# Altium schematic sheet IPMC_MACP 2.SchDoc
size A3
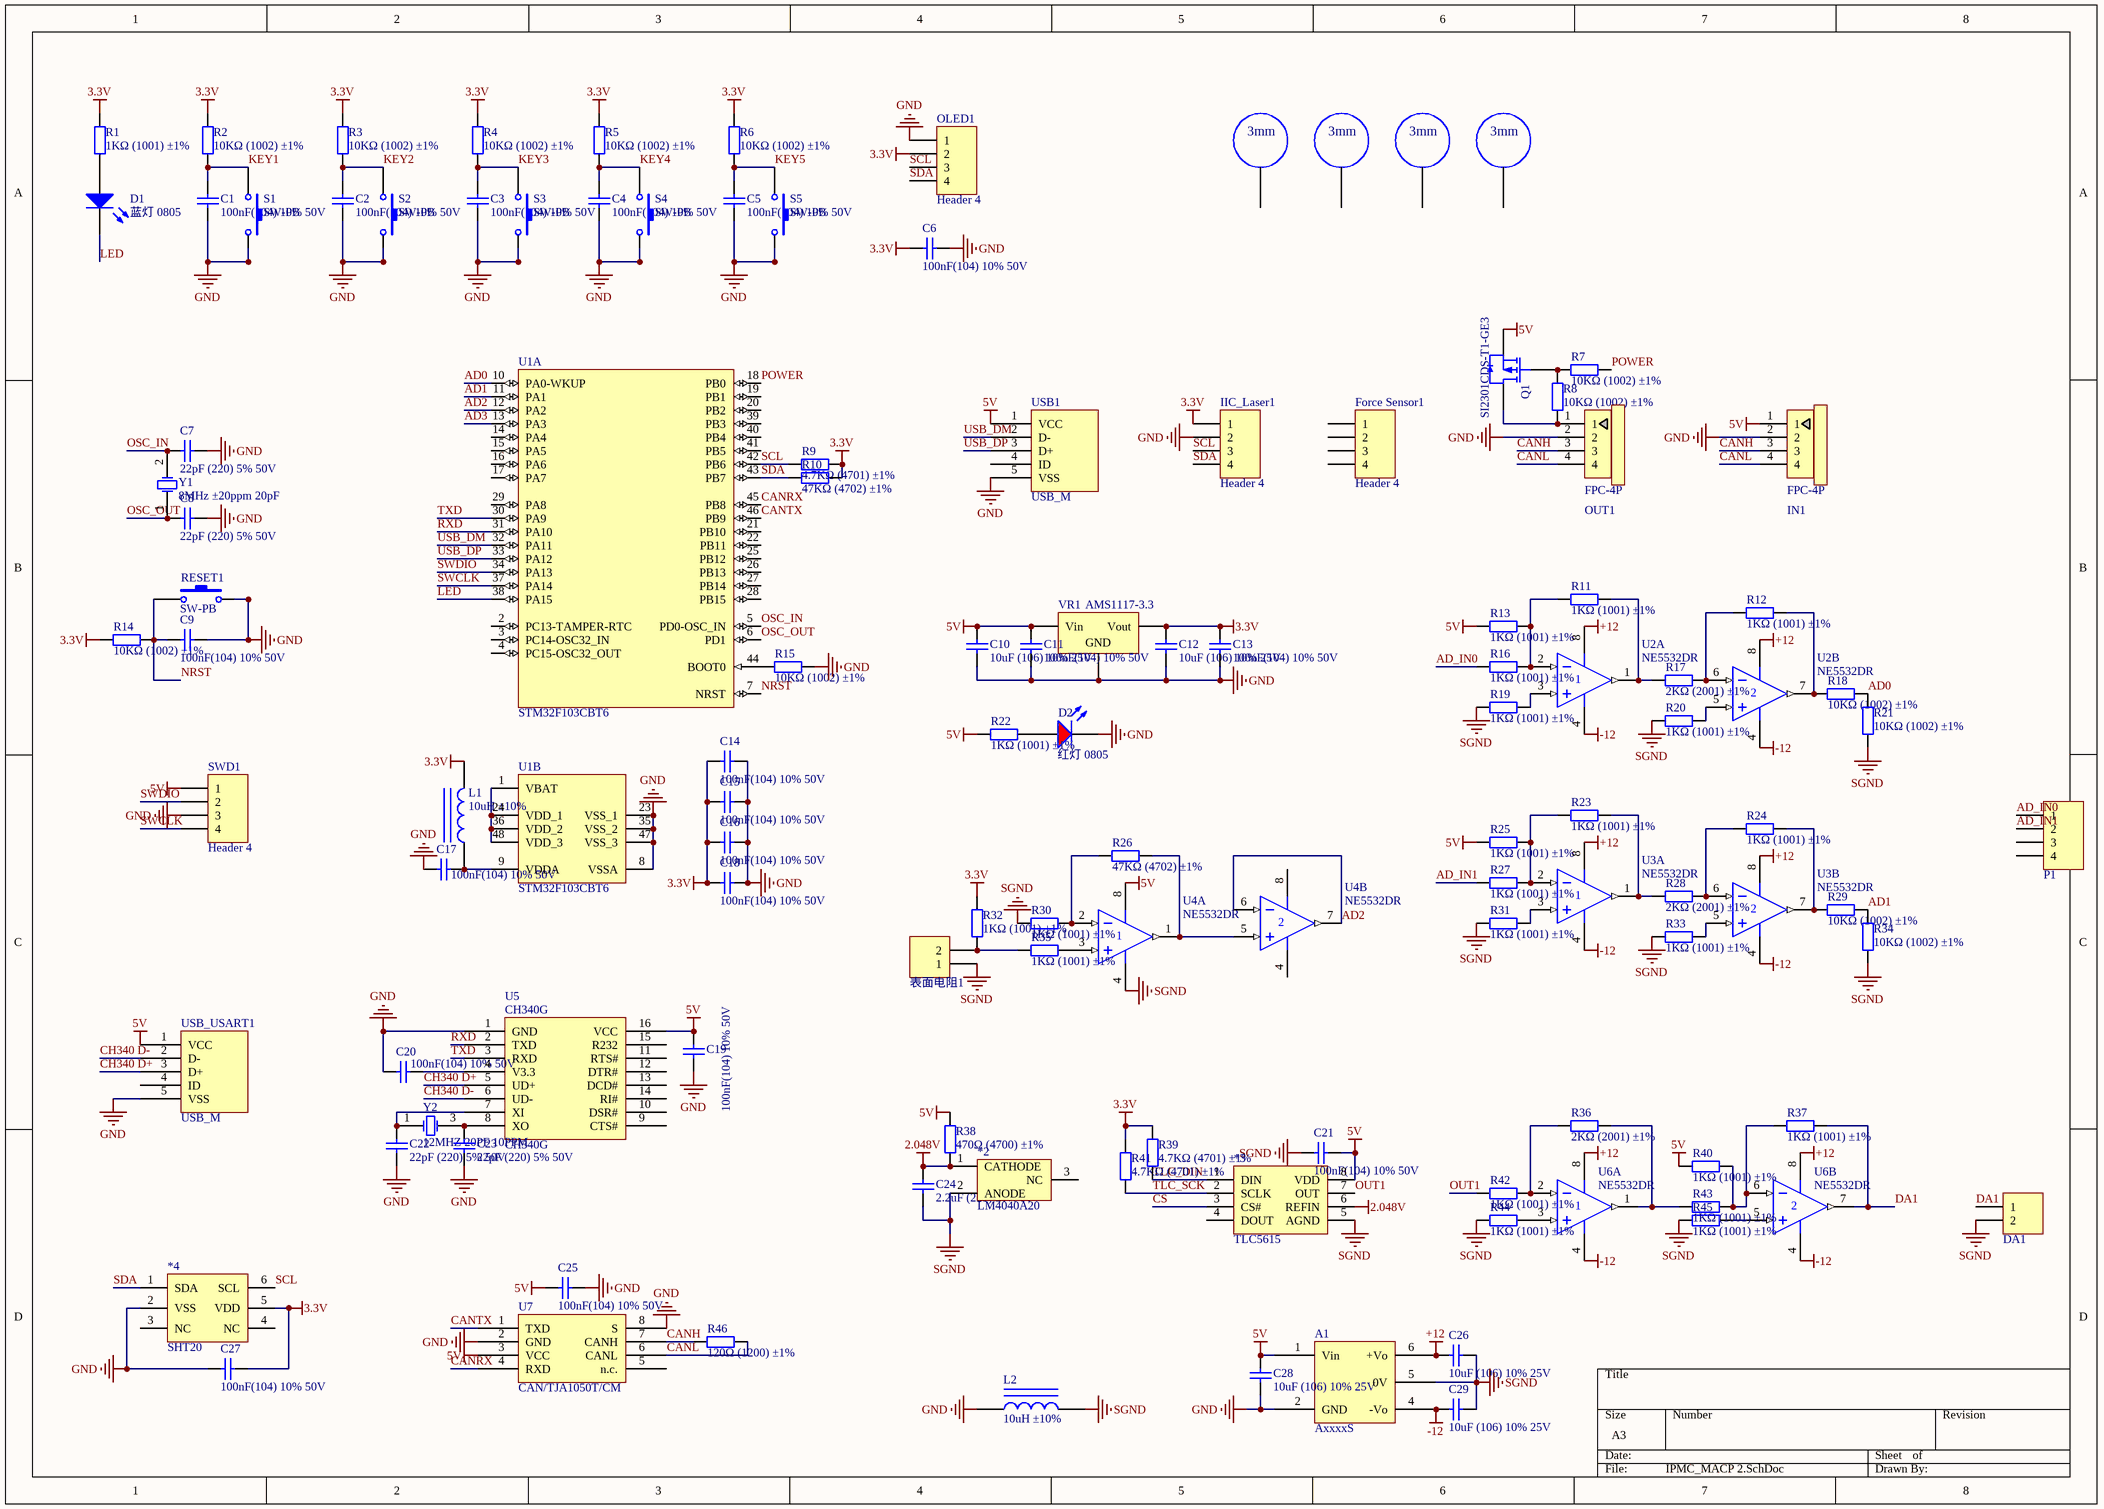
[diagram p0: IPMC_MACP 2.SchDoc]

## Parts
*2  LM4040A20  [SOT-23]
*3  TLC5615  [SOP-8]
*4  SHT20  [DFN6]
A1  AxxxxS  [AxxxxS]
C1  100nF(104) 10% 50V  [0805_C]
C2  100nF(104) 10% 50V  [0805_C]
C3  100nF(104) 10% 50V  [0805_C]
C4  100nF(104) 10% 50V  [0805_C]
C5  100nF(104) 10% 50V  [0805_C]
C6  100nF(104) 10% 50V  [0805_C]
C7  22pF (220) 5% 50V  [0805_C]
C8  22pF (220) 5% 50V  [0805_C]
C9  100nF(104) 10% 50V  [0805_C]
C10  10uF (106) 10% 25V  [0805_C]
C11  100nF(104) 10% 50V  [0805_C]
C12  10uF (106) 10% 25V  [0805_C]
C13  100nF(104) 10% 50V  [0805_C]
C14  100nF(104) 10% 50V  [0805_C]
C15  100nF(104) 10% 50V  [0805_C]
C16  100nF(104) 10% 50V  [0805_C]
C17  100nF(104) 10% 50V  [0805_C]
C18  100nF(104) 10% 50V  [0805_C]
C19  100nF(104) 10% 50V  [0805_C]
C20  100nF(104) 10% 50V  [0805_C]
C21  100nF(104) 10% 50V  [0805_C]
C22  22pF (220) 5% 50V  [0805_C]
C23  22pF (220) 5% 50V  [0805_C]
C24  2.2uF (225) 20% 50V  [0805_C]
C25  100nF(104) 10% 50V  [0805_C]
C26  10uF (106) 10% 25V  [0805_C]
C27  100nF(104) 10% 50V  [0805_C]
C28  10uF (106) 10% 25V  [0805_C]
C29  10uF (106) 10% 25V  [0805_C]
D1  蓝灯 0805  [0805_LED_S1]
D2  红灯 0805  [0805_LED_S1]
DA1  Header 2  [HDR2X1_A]  (value not drawn)
Force_Sensor1  Header 4  [HDR1X4]
IIC_Laser1  Header 4  [HDR1X4]
IN1  FPC-4P  [FPC1.0-4P-A]
L1  10uH ±10%  [0805_L]
L2  10uH ±10%  [0805_L]
OLED1  Header 4  [HDR1X4]
OUT1  FPC-4P  [FPC1.0-4P-A]
P1  Header 4  [HDR4X1_A]  (value not drawn)
Q1  SI2301CDS-T1-GE3  [SOT-23(SOT-23-3)]
R1  1KΩ (1001) ±1%  [0805_R]
R2  10KΩ (1002) ±1%  [0805_R]
R3  10KΩ (1002) ±1%  [0805_R]
R4  10KΩ (1002) ±1%  [0805_R]
R5  10KΩ (1002) ±1%  [0805_R]
R6  10KΩ (1002) ±1%  [0805_R]
R7  10KΩ (1002) ±1%  [0805_R]
R8  10KΩ (1002) ±1%  [0805_R]
R9  4.7KΩ (4701) ±1%  [0805_R]
R10  47KΩ (4702) ±1%  [0805_R]
R11  1KΩ (1001) ±1%  [0805_R]
R12  1KΩ (1001) ±1%  [0805_R]
R13  1KΩ (1001) ±1%  [0805_R]
R14  10KΩ (1002) ±1%  [0805_R]
R15  10KΩ (1002) ±1%  [0805_R]
R16  1KΩ (1001) ±1%  [0805_R]
R17  2KΩ (2001) ±1%  [0805_R]
R18  10KΩ (1002) ±1%  [0805_R]
R19  1KΩ (1001) ±1%  [0805_R]
R20  1KΩ (1001) ±1%  [0805_R]
R21  10KΩ (1002) ±1%  [0805_R]
R22  1KΩ (1001) ±1%  [0805_R]
R23  1KΩ (1001) ±1%  [0805_R]
R24  1KΩ (1001) ±1%  [0805_R]
R25  1KΩ (1001) ±1%  [0805_R]
R26  47KΩ (4702) ±1%  [0805_R]
R27  1KΩ (1001) ±1%  [0805_R]
R28  2KΩ (2001) ±1%  [0805_R]
R29  10KΩ (1002) ±1%  [0805_R]
R30  1KΩ (1001) ±1%  [0805_R]
R31  1KΩ (1001) ±1%  [0805_R]
R32  1KΩ (1001) ±1%  [0805_R]
R33  1KΩ (1001) ±1%  [0805_R]
R34  10KΩ (1002) ±1%  [0805_R]
R35  1KΩ (1001) ±1%  [0805_R]
R36  2KΩ (2001) ±1%  [0805_R]
R37  1KΩ (1001) ±1%  [0805_R]
R38  470Ω (4700) ±1%  [0805_R]
R39  4.7KΩ (4701) ±1%  [0805_R]
R40  1KΩ (1001) ±1%  [0805_R]
R41  4.7KΩ (4701) ±1%  [0805_R]
R42  1KΩ (1001) ±1%  [0805_R]
R43  1KΩ (1001) ±1%  [0805_R]
R44  1KΩ (1001) ±1%  [0805_R]
R45  1KΩ (1001) ±1%  [0805_R]
R46  120Ω (1200) ±1%  [0805_R]
RESET1  SW-PB  [SW_PB2_A1]
S1  SW-PB  [SW_PB2_A1]
S2  SW-PB  [SW_PB2_A1]
S3  SW-PB  [SW_PB2_A1]
S4  SW-PB  [SW_PB2_A1]
S5  SW-PB  [SW_PB2_A1]
SWD1  Header 4  [HDR1X4]
T1  M3铜柱螺丝孔  [螺丝孔-3mm]  (value not drawn)
T2  M3铜柱螺丝孔  [螺丝孔-3mm]  (value not drawn)
T3  M3铜柱螺丝孔  [螺丝孔-3mm]  (value not drawn)
T4  M3铜柱螺丝孔  [螺丝孔-3mm]  (value not drawn)
U1  STM32F103CBT6  [LQFP-48_7x7x05P]  (parts A,B of 2)
U2  NE5532DR  [SOIC-8_150mil]  (parts A,B of 2)
U3  NE5532DR  [SOIC-8_150mil]  (parts A,B of 2)
U4  NE5532DR  [SOIC-8_150mil]  (parts A,B of 2)
U5  CH340G  [SOIC-16_150mil]
U6  NE5532DR  [SOIC-8_150mil]  (parts A,B of 2)
U7  CAN/TJA1050T/CM  [SOIC-8_150mil]
USB1  USB_M  [USB_MICRO]
USB_USART1  USB_M  [USB_MICRO]
VR1  AMS1117-3.3  [SOT-223]
Y1  8MHz ±20ppm 20pF  [SMD-5032_2P]
Y2  12MHZ 20PF 10PPM  [SMD-3225_4P]
表面电阻1  Header 2  [HDR2X1_A]  (value not drawn)

## Nets
2.048V: *2.1(CATHODE) *3.6(REFIN) C24.2 R38.1
3.3V: *4.5(VDD) C6.2 C12.2 C13.2 C14.2 C15.2 C16.2 C18.2 C27.2 IIC_Laser1.1 L1.2 OLED1.2 R1.1 R2.1 R3.1 R4.1 R5.1 R6.1 R9.2 R10.2 R14.1 R32.1 R39.2 R41.2 VR1.2(Vout)
5V: *3.8(VDD) A1.1(Vin) C10.2 C11.2 C19.2 C21.1 C25.2 C28.2 IN1.1 Q1.2(S) R13.2 R22.1 R25.2 R38.2 R40.2 SWD1.1 U4.8(V+) U5.16(VCC) U7.3(VCC) USB1.1(VCC) USB_USART1.1(VCC) VR1.3(Vin)
+12: A1.6(+Vo) C26.1 U2.8(V+) U3.8(V+) U6.8(V+)
-12: A1.4(-Vo) C29.1 U2.4(V-) U3.4(V-) U6.4(V-)
GND: *4.2(VSS) A1.2(GND) C1.2 C2.2 C3.2 C4.2 C5.2 C6.1 C7.1 C8.1 C9.2 C10.1 C11.1 C12.1 C13.1 C14.1 C15.1 C16.1 C17.1 C18.1 C19.1 C20.2 C22.1 C23.1 C25.1 C27.1 C28.1 D2.K IIC_Laser1.2 IN1.2 L2.1 OLED1.1 OUT1.2 R15.2 RESET1.2 S1.2 S2.2 S3.2 S4.2 S5.2 SWD1.3 U1.8(VSSA) U1.23(VSS_1) U1.35(VSS_2) U1.47(VSS_3) U5.1(GND) U7.2(GND) U7.8(S) USB1.5(VSS) USB_USART1.5(VSS) VR1.1(GND)
SGND: *2.2(ANODE) *3.5(AGND) A1.5(0V) C21.2 C24.1 C26.2 C29.2 DA1.2 L2.2 R19.2 R20.2 R21.1 R30.1 R31.2 R33.2 R34.1 R44.2 R45.2 U4.4(V-) 表面电阻1.1
AD0: R18.2 R21.2 U1.10(PA0-WKUP)
AD1: R29.2 R34.2 U1.11(PA1)
AD2: U1.12(PA2) U4.6(IN-) U4.7(OUT)
AD3: U1.13(PA3)
AD_IN0: P1.1 R16.2
AD_IN1: P1.2 R27.2
CANH: IN1.3 OUT1.3 R46.1 U7.7(CANH)
CANL: IN1.4 OUT1.4 R46.2 U7.6(CANL)
CANRX: U1.45(PB8) U7.4(RXD)
CANTX: U1.46(PB9) U7.1(TXD)
CH340 D+: U5.5(UD+) USB_USART1.3(D+)
CH340 D-: U5.6(UD-) USB_USART1.2(D-)
CS: *3.3(CS#)
DA1: DA1.1 R37.1 U6.7(OUT)
KEY1: C1.1 R2.2 S1.1
KEY2: C2.1 R3.2 S2.1
KEY3: C3.1 R4.2 S3.1
KEY4: C4.1 R5.2 S4.1
KEY5: C5.1 R6.2 S5.1
LED: D1.K U1.38(PA15)
NRST: C9.1 R14.2 RESET1.1 U1.7(NRST)
OSC_IN: C7.2 U1.5(PD0-OSC_IN) Y1.2(OSC2)
OSC_OUT: C8.2 U1.6(PD1) Y1.1(OSC1)
OUT1: *3.7(OUT) R42.2
POWER: R7.2 U1.18(PB0)
RXD: U1.31(PA10) U5.2(TXD)
SCL: *4.6(SCL) IIC_Laser1.3 OLED1.3 R9.1 U1.42(PB6)
SDA: *4.1(SDA) IIC_Laser1.4 OLED1.4 R10.1 U1.43(PB7)
SWCLK: SWD1.4 U1.37(PA14)
SWDIO: SWD1.2 U1.34(PA13)
TLC_DIN: *3.1(DIN) R39.1
TLC_SCK: *3.2(SCLK) R41.1
TXD: U1.30(PA9) U5.3(RXD)
USB_DM: U1.32(PA11) USB1.2(D-)
USB_DP: U1.33(PA12) USB1.3(D+)
NetC17_2: C17.2 L1.1 U1.9(VDDA)
NetC20_1: C20.1 U5.4(V3.3)
NetC22_2: C22.2 U5.7(XI) Y2.1(OSC1)
NetC23_2: C23.2 U5.8(XO) Y2.3(OSC2)
NetD1_A: D1.A R1.2
NetD2_A: D2.A R22.2
NetOUT1_1: OUT1.1 Q1.3(D) R8.2
NetQ1_1: Q1.1(G) R7.1 R8.1
NetR11_1: R11.1 R17.1 U2.1(OUT)
NetR11_2: R11.2 R13.1 R16.1 U2.2(IN-)
NetR12_1: R12.1 R18.1 U2.7(OUT)
NetR12_2: R12.2 R17.2 U2.6(IN-)
NetR15_1: R15.1 U1.44(BOOT0)
NetR19_1: R19.1 U2.3(IN+)
NetR20_1: R20.1 U2.5(IN+)
NetR23_1: R23.1 R28.1 U3.1(OUT)
NetR23_2: R23.2 R25.1 R27.1 U3.2(IN-)
NetR24_1: R24.1 R29.1 U3.7(OUT)
NetR24_2: R24.2 R28.2 U3.6(IN-)
NetR26_1: R26.1 R30.2 U4.2(IN-)
NetR26_2: R26.2 U4.1(OUT) U4.5(IN+)
NetR31_1: R31.1 U3.3(IN+)
NetR32_2: R32.2 R35.1 表面电阻1.2
NetR33_1: R33.1 U3.5(IN+)
NetR35_2: R35.2 U4.3(IN+)
NetR36_1: R36.1 R42.1 U6.2(IN-)
NetR36_2: R36.2 R43.2 U6.1(OUT)
NetR37_2: R37.2 R40.1 R43.1 U6.6(IN-)
NetR44_1: R44.1 U6.3(IN+)
NetR45_1: R45.1 U6.5(IN+)
NetU1_1: U1.1(VBAT) U1.24(VDD_1) U1.36(VDD_2) U1.48(VDD_3)

Not connected (* = marked no-connect by the designer): *2 3(NC); *3 4(DOUT); *4 3(NC) 4(NC); Force_Sensor1 1 2 3 4; P1 3 4; T1 1; T2 1; T3 1; T4 1; U1 2(PC13-TAMPER-RTC) 3(PC14-OSC32_IN) 4(PC15-OSC32_OUT) 14(PA4) 15(PA5) 16(PA6) 17(PA7) 19(PB1) 20(PB2) 21(PB10) 22(PB11) 25(PB12) 26(PB13) 27(PB14) 28(PB15) 29(PA8) 39(PB3) 40(PB4) 41(PB5); U5 9(CTS#) 10(DSR#) 11(RTS#) 12(DTR#) 13(DCD#) 14(RI#) 15(R232); U7 5(n.c.); USB1 4(ID); USB_USART1 4(ID)

## Notes on the sheet
- (in symbol M3铜柱螺丝孔) 3mm

## Library data of the parts
*2 = LM4040A20: 2.048V基准电压芯片
*3 = TLC5615: 单通道10bitDA数模转换器
A1 = AxxxxS: 能达电源模块
C1-C6 C9 C11 C13-C21 C25 C27 = 0805 100nF(104) 10% 50V: 贴片电容; ComponentLink1Description: 供应商链接; ComponentLink1URL: http://www.szlcsc.com/product/details_50686.html; Package: 0805; Supplier: LC; SuppliersPartNumber: C49678
C7 C8 C22 C23 = 0805 22pF (220) 5% 50V: 贴片电容; ComponentLink1Description: 供应商链接; ComponentLink1URL: http://www.szlcsc.com/product/details_2156.html; Package: 0805; Supplier: LC; SuppliersPartNumber: C1804
C10 C12 C26 C28 C29 = 0805 10uF (106) 10% 25V: 贴片电容; ComponentLink1Description: 供应商链接; ComponentLink1URL: http://www.szlcsc.com/product/details_16532.html; Package: 0805; Supplier: LC; SuppliersPartNumber: C15850
C24 = 0805 2.2uF (225) 20% 50V: 贴片电容; ComponentLink1Description: 供应商链接; ComponentLink1URL: http://www.szlcsc.com/product/details_50225.html; Package: 0805; Supplier: LC; SuppliersPartNumber: C49217
D1 = 0805 蓝灯: 发光二极管; ComponentLink1Description: 供应商链接; ComponentLink1URL: http://www.szlcsc.com/product/details_2666.html; Package: 0805; Supplier: LC; SuppliersPartNumber: C2293
D2 = 0805 红灯: 发光二极管; ComponentLink1Description: 供应商链接; ComponentLink1URL: http://www.szlcsc.com/product/details_2668.html; Package: 0805; Supplier: LC; SuppliersPartNumber: C2295
DA1 表面电阻1 = Header 2: 接插件; LatestRevisionDate: 17-Jul-2002; LatestRevisionNote: Re-released for DXP Platform.; Publisher: Altium Limited
Force_Sensor1 IIC_Laser1 OLED1 SWD1 = Header 4: Header, 4-Pin; LatestRevisionDate: 17-Jul-2002; LatestRevisionNote: Re-released for DXP Platform.; Publisher: Altium Limited
IN1 OUT1 = FPC-4P: FPC排线连接器
L1 L2 = 0805 10uH 10%: 贴片电感; ComponentLink1Description: 供应商链接; ComponentLink1URL: http://www.szlcsc.com/product/details_1398.html; Package: 0805; Supplier: LC; SuppliersPartNumber: C1046
P1 = Header 4: 接插件; LatestRevisionDate: 17-Jul-2002; LatestRevisionNote: Re-released for DXP Platform.; Publisher: Altium Limited
Q1 = SI2301CDS-T1-GE3: MOS(场效应管); ComponentLink1Description: 供应商链接; ComponentLink1URL: http://www.szlcsc.com/product/details_11030.html; Package: SOT-23(SOT-23-3); Supplier: LC; SuppliersPartNumber: C10487
R1 R11-R13 R16 R19 R20 R22-R25 R27 R30-R33 R35 R37 R40 R42-R45 = 0805 1KΩ (1001) 1%: 贴片电阻; ComponentLink1Description: 供应商链接; ComponentLink1URL: http://www.szlcsc.com/product/details_18201.html; Package: 0805; Supplier: LC; SuppliersPartNumber: C17513
R2-R8 R14 R15 R18 R21 R29 R34 = 0805 10KΩ (1002) 1%: 贴片电阻; ComponentLink1Description: 供应商链接; ComponentLink1URL: http://www.szlcsc.com/product/details_18102.html; Package: 0805; Supplier: LC; SuppliersPartNumber: C17414
R9 R39 R41 = 0805 4.7KΩ (4701) 1%: 贴片电阻; ComponentLink1Description: 供应商链接; ComponentLink1URL: http://www.szlcsc.com/product/details_18361.html; Package: 0805; Supplier: LC; SuppliersPartNumber: C17673
R10 R26 = 0805 47KΩ (4702) 1%: 贴片电阻; ComponentLink1Description: 供应商链接; ComponentLink1URL: http://www.szlcsc.com/product/details_18401.html; Package: 0805; Supplier: LC; SuppliersPartNumber: C17713
R17 R28 R36 = 0805 2KΩ (2001) 1%: 贴片电阻; ComponentLink1Description: 供应商链接; ComponentLink1URL: http://www.szlcsc.com/product/details_18292.html; Package: 0805; Supplier: LC; SuppliersPartNumber: C17604
R38 = 0805 470Ω (4700) 1%: 贴片电阻; ComponentLink1Description: 供应商链接; ComponentLink1URL: http://www.szlcsc.com/product/details_18398.html; Package: 0805; Supplier: LC; SuppliersPartNumber: C17710
R46 = 0805 120Ω (1200) 1%: 贴片电阻; ComponentLink1Description: 供应商链接; ComponentLink1URL: http://www.szlcsc.com/product/details_18125.html; Package: 0805; Supplier: LC; SuppliersPartNumber: C17437
RESET1 S1-S5 = SW-PB: 微动开关; Published: 24-Mar-1999; LatestRevisionDate: 17-Jul-2002; LatestRevisionNote: Re-released for DXP Platform.; PackageReference: SPST-2; Publisher: Altium Limited
U1 = STM32F103CBT6: ARM; ComponentLink1Description: 供应商链接; ComponentLink1URL: http://www.szlcsc.com/product/details_8796.html; Package: LQFP-48_7x7x05P; Supplier: LC; SuppliersPartNumber: C8304
U2-U4 U6 = NE5532DR: 功放; ComponentLink1Description: 供应商链接; ComponentLink1URL: http://www.szlcsc.com/product/details_7903.html; Package: SOIC-8_150mil; Supplier: LC; SuppliersPartNumber: C7426
U5 = CH340G: USB; ComponentLink1Description: 供应商链接; ComponentLink1URL: http://www.szlcsc.com/product/details_14927.html; Package: SOIC-16_150mil; Supplier: LC; SuppliersPartNumber: C14267
U7 = CAN/TJA1050T/CM: CAN; ComponentLink1Description: 供应商链接; ComponentLink1URL: http://www.szlcsc.com/product/details_7424.html; Package: SOIC-8_150mil; Supplier: LC; SuppliersPartNumber: C6952
USB1 USB_USART1 = USB_M: MicroUSB接口
VR1 = SOT-223 AMS1117-3.3: 低压差线性稳压(LDO); ComponentLink1Description: 供应商链接; ComponentLink1URL: http://www.szlcsc.com/product/details_6652.html; Package: SOT-223; Supplier: LC; SuppliersPartNumber: C6186
Y1 = SMD-5032_2P 8MHz 20ppm 20pF: 贴片晶振; ComponentLink1Description: 供应商链接; ComponentLink1URL: http://www.szlcsc.com/product/details_117214.html; Package: SMD-5032_2P; Supplier: LC; SuppliersPartNumber: C115962
Y2 = SMD-3225_4P  12MHZ 20PF 10PPM: 贴片晶振; ComponentLink1Description: 供应商链接; ComponentLink1URL: http://www.szlcsc.com/product/details_9522.html; Package: SMD-3225_4P; Supplier: LC; SuppliersPartNumber: C9002